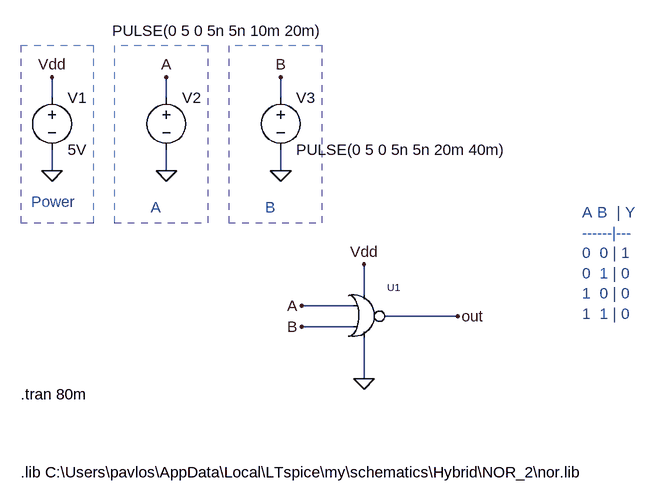
[diagram p0: schematic nor_block.asc]
nor_block.asc, the LTspice schematic file:
Version 4
SHEET 1 880 680
WIRE -560 -416 -560 -448
WIRE -384 -416 -384 -448
WIRE -208 -416 -208 -448
WIRE -560 -304 -560 -336
WIRE -384 -304 -384 -336
WIRE -208 -304 -208 -336
WIRE -80 -112 -80 -160
WIRE -96 -96 -176 -96
WIRE 64 -80 -48 -80
WIRE -96 -64 -176 -64
WIRE -80 16 -80 -48
FLAG 64 -80 out
FLAG -176 -96 A
FLAG -80 -160 Vdd
FLAG -80 16 0
FLAG -560 -304 0
FLAG -560 -448 Vdd
FLAG -384 -304 0
FLAG -384 -448 A
FLAG -176 -64 B
FLAG -208 -304 0
FLAG -208 -448 B
SYMBOL voltage -560 -432 R0
WINDOW 123 0 0 Left 0
WINDOW 39 0 0 Left 0
SYMATTR InstName V1
SYMATTR Value 5V
SYMBOL voltage -384 -432 R0
WINDOW 123 0 0 Left 0
WINDOW 39 0 0 Left 0
WINDOW 3 -83 -87 Left 2
SYMATTR InstName V2
SYMATTR Value PULSE(0 5 0 5n 5n 10m 20m)
SYMBOL voltage -208 -432 R0
WINDOW 123 0 0 Left 0
WINDOW 39 0 0 Left 0
SYMATTR InstName V3
SYMATTR Value PULSE(0 5 0 5n 5n 20m 40m)
SYMBOL nor -112 -48 R0
SYMATTR InstName U1
TEXT -592 -256 Left 2 ;Power
TEXT -408 -248 Left 2 ;A
TEXT -608 40 Left 2 !.tran 80m
TEXT -608 160 Left 2 !.lib C:\\Users\\pavlos\\AppData\\Local\\LTspice\\my\\schematics\\Hybrid\\NOR_2\\nor.lib
TEXT -232 -248 Left 2 ;B
TEXT 256 -240 Left 2 ;A B  | Y\n------|---\n0  0 | 1\n0  1 | 0\n1  0 | 0\n1  1 | 0
RECTANGLE Normal -496 -496 -608 -224 2
RECTANGLE Normal -320 -496 -464 -224 2
RECTANGLE Normal -144 -496 -288 -224 2

The netlist it stands for:
* nor_block.asc
V1 Vdd 0 5V
V2 A 0 PULSE(0 5 0 5n 5n 10m 20m)
V3 B 0 PULSE(0 5 0 5n 5n 20m 40m)
XU1 A B out Vdd 0 nor  ; pins A B Y Vdd Vss
* Power
* A
.tran 80m
.lib C:\Users\pavlos\AppData\Local\LTspice\my\schematics\Hybrid\NOR_2\nor.lib
* B
* A B  | Y
* ------|---
* 0  0 | 1
* 0  1 | 0
* 1  0 | 0
* 1  1 | 0
.backanno
.end

* Results of the author's LTspice run, read from the files saved beside the schematic
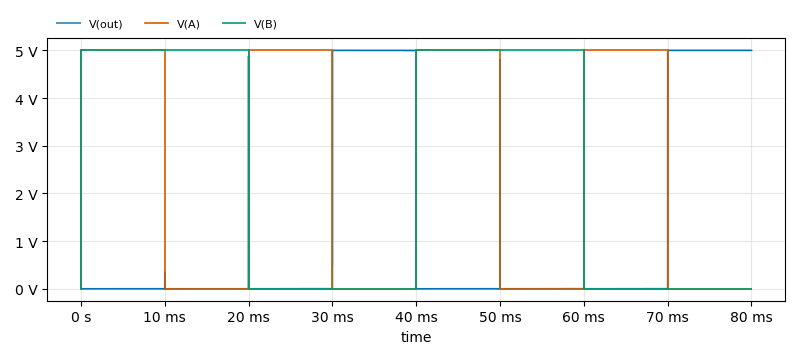
[diagram p1: Transient Analysis of nor_block.asc, plotted from the saved traces]
* Transient Analysis, 1 run:
*   V(out): min 0 V, max 5 V, average 1.25 V, rms 2.5 V, last 5 V
*   V(A): min 0 V, max 5 V, average 2.5 V, rms 3.536 V, last 0 V
*   V(B): min 0 V, max 5 V, average 2.5 V, rms 3.536 V, last 0 V